# Altium project RFID_Reader_Writer.PrjPcb
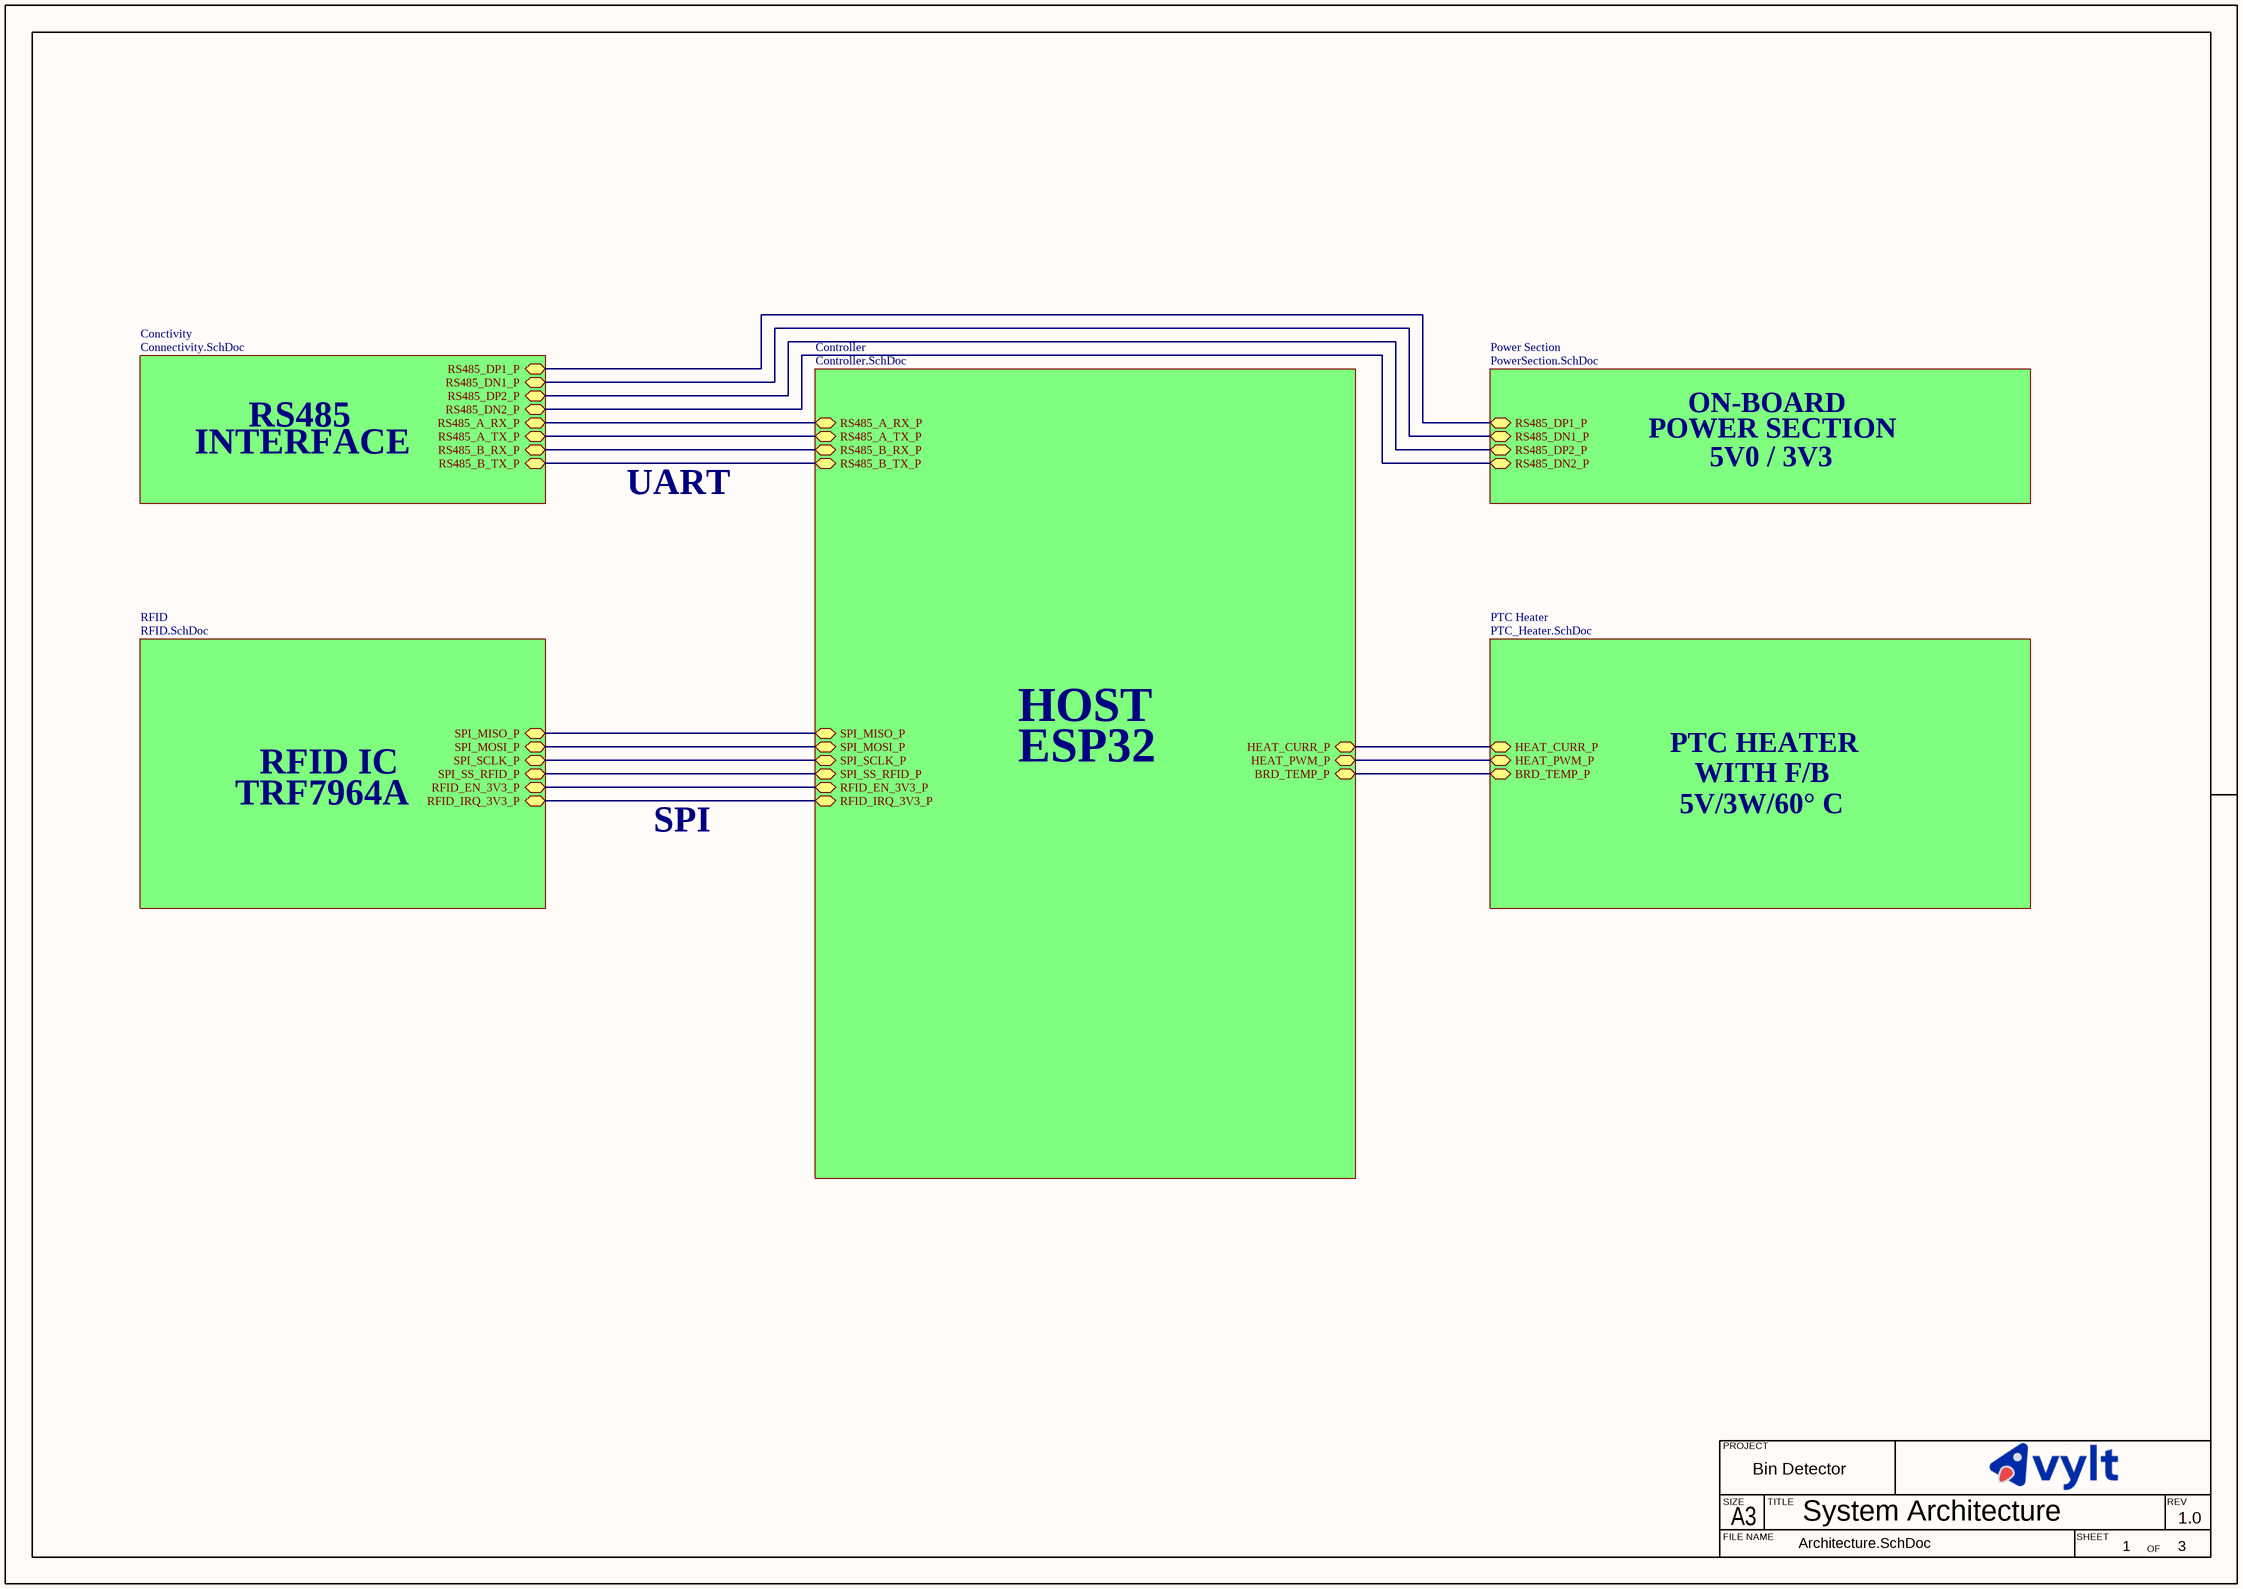
[diagram p0: Architecture.SchDoc]
Project: Bin Detector; Revision: 1.0
2 sheets, 27 parts. Net scope: hierarchical (ports join the sheet entries above them; power ports are global).
Board file: RFID_Reader_Writer.PcbDoc
Sheets:
  Architecture.SchDoc
    Controller = Controller.SchDoc

## Sheet Architecture.SchDoc: System Architecture
size 420 x 297 mm; SheetNumber: 1; SheetTotal: 3; DOC_NO_SCH_DWG: 1

### Sub-sheets
Conctivity = Connectivity.SchDoc (file not in this document): RS485_A_TX_P (bidir), RS485_A_RX_P (bidir), RS485_DP1_P (bidir), RS485_DN1_P (bidir), RS485_B_TX_P (bidir), RS485_B_RX_P (bidir), RS485_DP2_P (bidir), RS485_DN2_P (bidir)
Controller = Controller.SchDoc: SPI_MOSI_P (bidir), SPI_SCLK_P (bidir), SPI_SS_RFID_P (bidir), RFID_EN_3V3_P (bidir), RFID_IRQ_3V3_P (bidir), RS485_A_TX_P (bidir), RS485_A_RX_P (bidir), SPI_MISO_P (bidir), HEAT_CURR_P (bidir), BRD_TEMP_P (bidir), HEAT_PWM_P (bidir), RS485_B_TX_P (bidir), RS485_B_RX_P (bidir)
Power Section = PowerSection.SchDoc (file not in this document): RS485_DP1_P (bidir), RS485_DN1_P (bidir), RS485_DP2_P (bidir), RS485_DN2_P (bidir)
PTC Heater = PTC_Heater.SchDoc (file not in this document): HEAT_CURR_P (bidir), BRD_TEMP_P (bidir), HEAT_PWM_P (bidir)
RFID = RFID.SchDoc (file not in this document): SPI_MISO_P (bidir), SPI_MOSI_P (bidir), SPI_SCLK_P (bidir), SPI_SS_RFID_P (bidir), RFID_EN_3V3_P (bidir), RFID_IRQ_3V3_P (bidir)

### Nets
BRD_TEMP: sheet Controller/BRD_TEMP_P, sheet PTC Heater/BRD_TEMP_P
HEAT_CURR: sheet Controller/HEAT_CURR_P, sheet PTC Heater/HEAT_CURR_P
HEAT_PWM: sheet Controller/HEAT_PWM_P, sheet PTC Heater/HEAT_PWM_P
RFID_3V3_EN: sheet RFID/RFID_EN_3V3_P, sheet Controller/RFID_EN_3V3_P
RFID_3V3_IRQ: sheet RFID/RFID_IRQ_3V3_P, sheet Controller/RFID_IRQ_3V3_P
RS485_A_RX: sheet Controller/RS485_A_RX_P, sheet Conctivity/RS485_A_RX_P
RS485_A_TX: sheet Controller/RS485_A_TX_P, sheet Conctivity/RS485_A_TX_P
RS485_B_RX: sheet Controller/RS485_B_RX_P, sheet Conctivity/RS485_B_RX_P
RS485_B_TX: sheet Controller/RS485_B_TX_P, sheet Conctivity/RS485_B_TX_P
SPI_MISO: sheet RFID/SPI_MISO_P, sheet Controller/SPI_MISO_P
SPI_MOSI: sheet RFID/SPI_MOSI_P, sheet Controller/SPI_MOSI_P
SPI_RFID_SS: sheet RFID/SPI_SS_RFID_P, sheet Controller/SPI_SS_RFID_P
SPI_SCLK: sheet RFID/SPI_SCLK_P, sheet Controller/SPI_SCLK_P
(unnamed): sheet Conctivity/RS485_DP1_P, sheet Power Section/RS485_DP1_P
(unnamed): sheet Conctivity/RS485_DN1_P, sheet Power Section/RS485_DN1_P
(unnamed): sheet Conctivity/RS485_DP2_P, sheet Power Section/RS485_DP2_P
(unnamed): sheet Conctivity/RS485_DN2_P, sheet Power Section/RS485_DN2_P

### Notes on the sheet
- INTERFACE
- RS485
- POWER SECTION
- ON-BOARD
- UART
- 5V0 / 3V3
- HOST
- RFID IC
- ESP32
- PTC HEATER
- WITH F/B
- TRF7964A
- SPI
- 5V/3W/60° C
- PROJECT
- SIZE
- FILE NAME
- A3
- TITLE
- SHEET
- OF
- REV

## Sheet Controller.SchDoc: Controller Section
size 420 x 297 mm
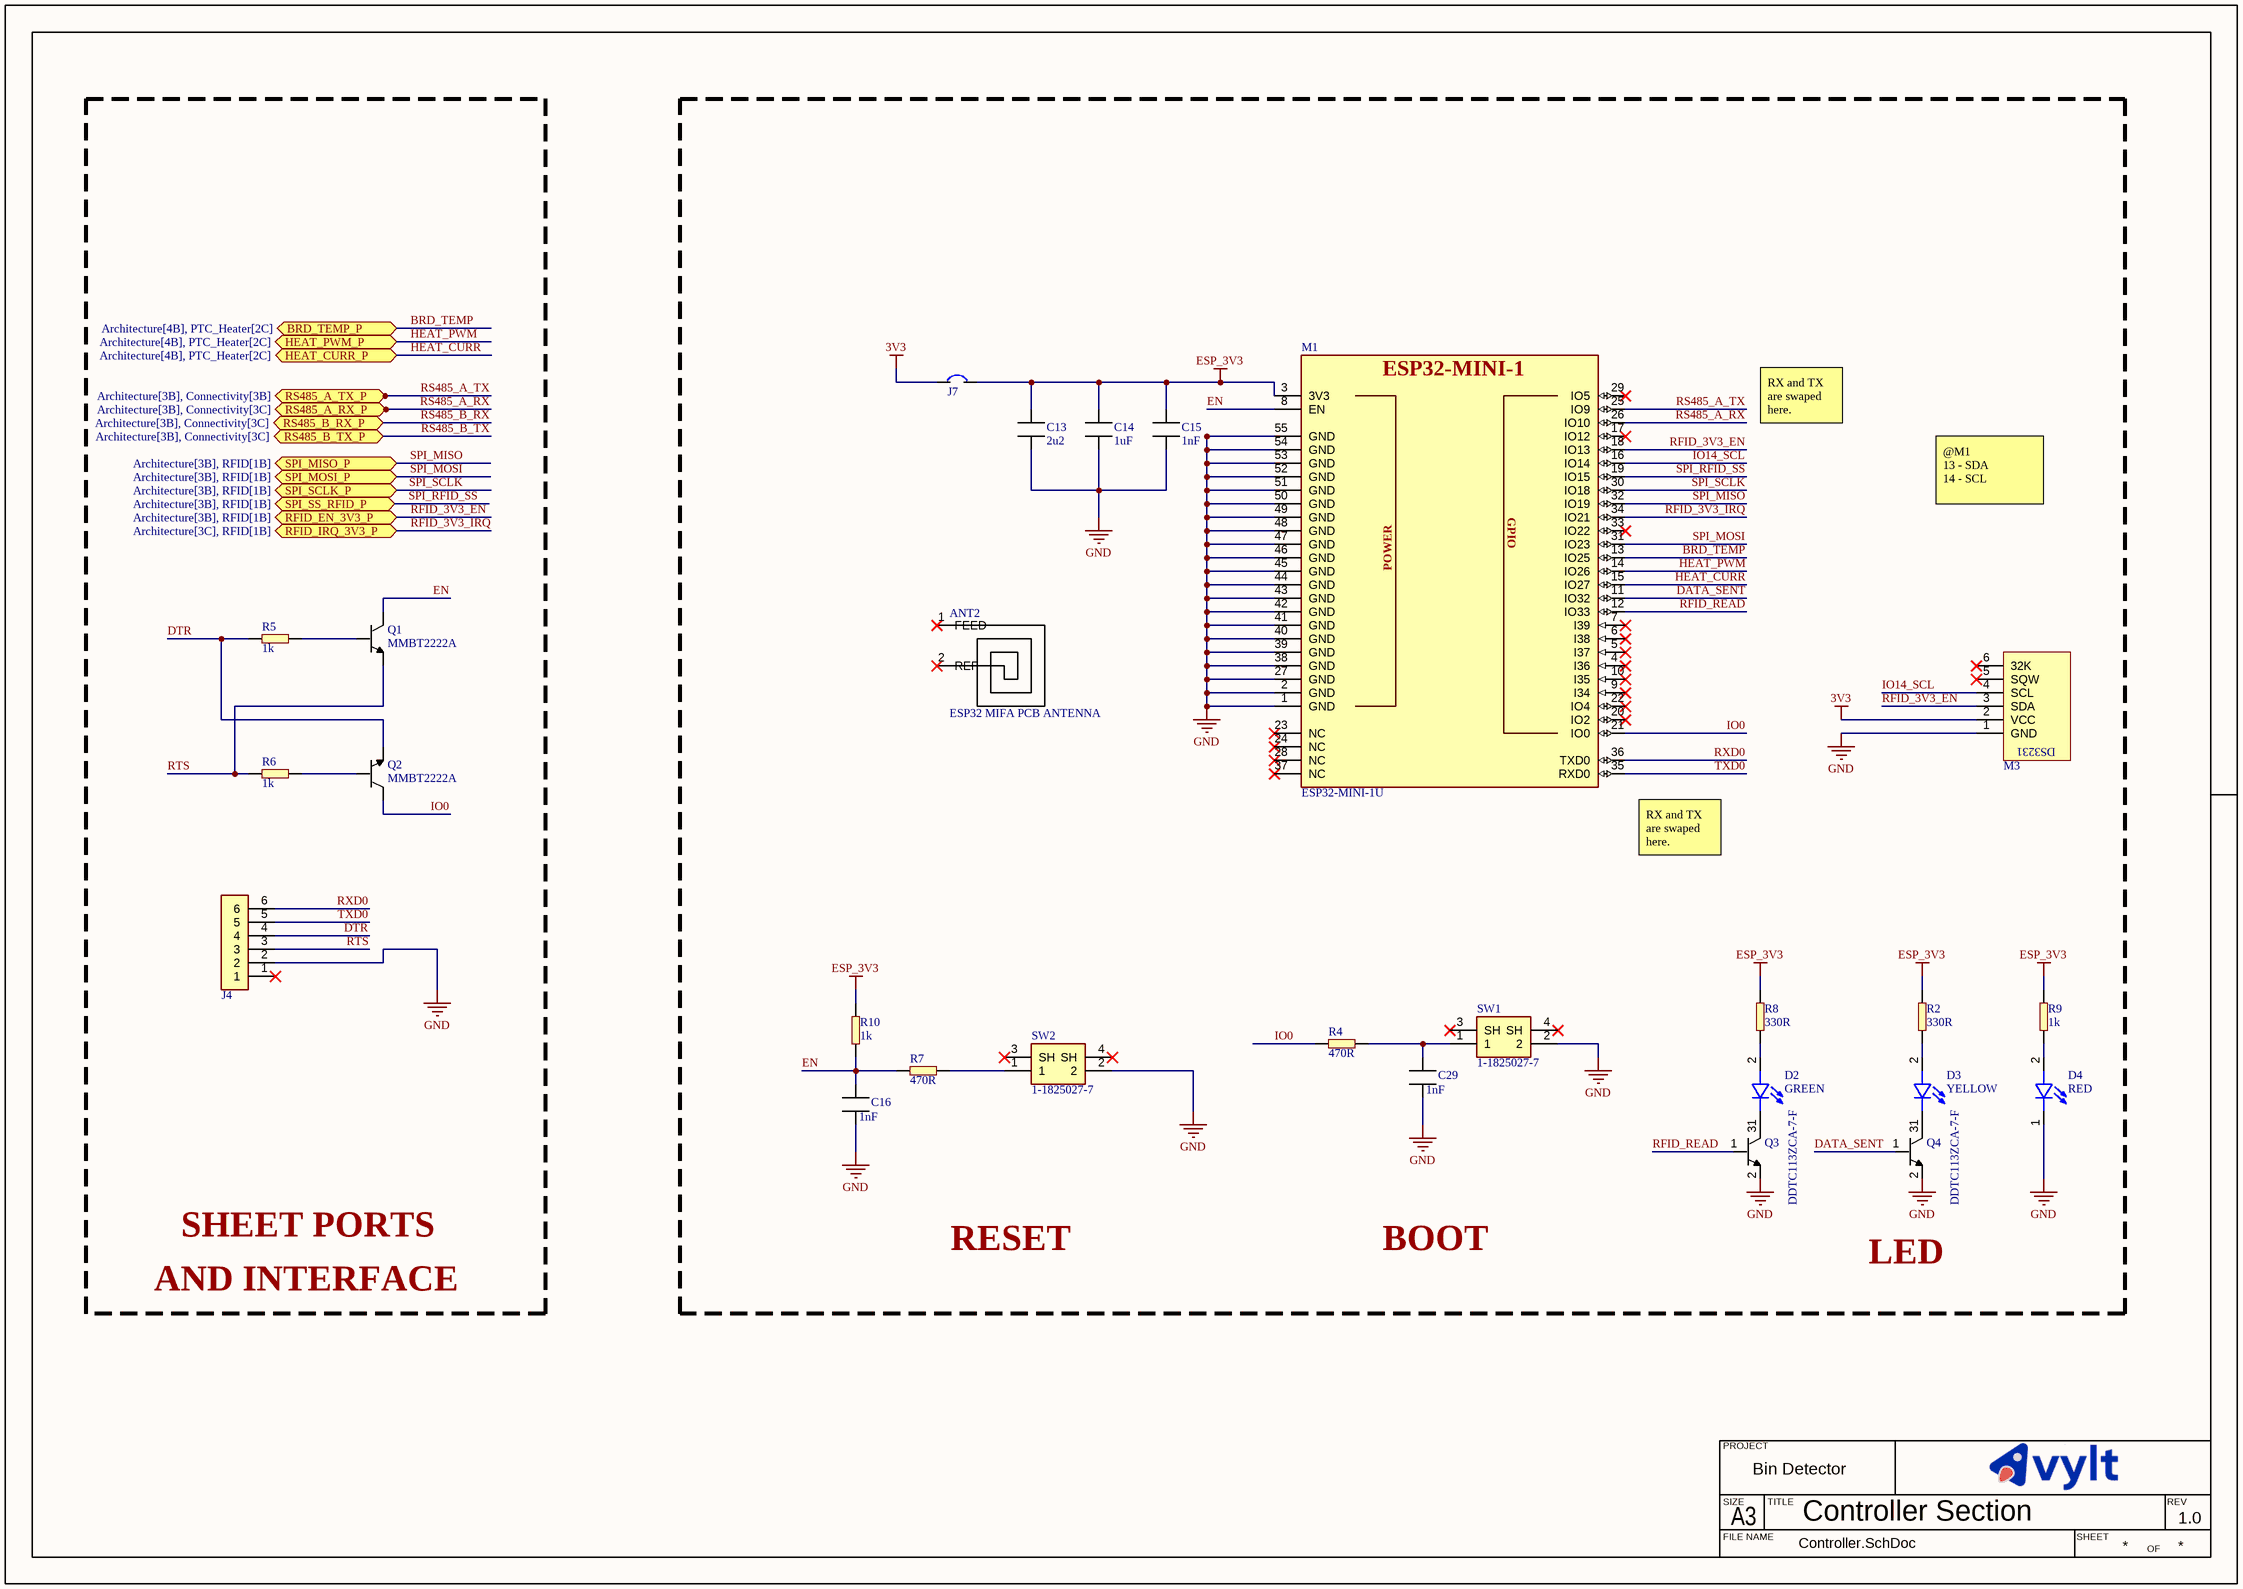
[diagram p1: Controller.SchDoc]

### Parts
ANT2  ESP32 MIFA PCB ANTENNA  [ESP32 MIFA PCB ANTENNA]  (no BOM)
C13  value 2u2  [CAPC1608X10N]  (hidden comment: ERP_102-1)
C14  value 1uF  [CAPC1608X10N]  (hidden comment: ERP_102-1)
C15  value 1nF  [CAPC1608X10N]  (hidden comment: ERP_102-1)
C16  value 1nF  [CAPC1608X10N]  (hidden comment: ERP_102-1)
C29  value 1nF  [CAPC1608X10N]  (hidden comment: ERP_102-1)
D2  value GREEN  [LED_2SMD]  (hidden comment: LED_2SMD)
D3  value YELLOW  [LED_2SMD]  (hidden comment: LED_2SMD)
D4  value RED  [LED_2SMD]  (hidden comment: LED_2SMD)
J4  ERP_148-2  [6PX1R]  (value not drawn)  (no BOM)
J7  Jumper_2P  [Jumper_2P]  (value not drawn)  (no BOM)
M1  value ESP32-MINI-1U  [ESP32_MINI_1U]  (hidden comment: ERP_140-3)
M3  DS3231_HW-084  [DS3231_HW-084]  (value not drawn)
Q1  value MMBT2222A  [MMBT2222]  (hidden comment: ERP_105-1)
Q2  value MMBT2222A  [MMBT2222]  (hidden comment: ERP_105-1)
Q3  value DDTC113ZCA-7-F  [DDTCXXXXCA]  (hidden comment: ERP_105-1)
Q4  value DDTC113ZCA-7-F  [DDTCXXXXCA]  (hidden comment: ERP_105-1)
R2  value 330R  [RES_0603]  (hidden comment: ERP_101-1)
R4  value 470R  [RES_0603]  (hidden comment: ERP_101-1)
R5  value 1k  [RES_0603]  (hidden comment: ERP_101-1)
R6  value 1k  [RES_0603]  (hidden comment: ERP_101-1)
R7  value 470R  [RES_0603]  (hidden comment: ERP_101-1)
R8  value 330R  [RES_0603]  (hidden comment: ERP_101-1)
R9  value 1k  [RES_0603]  (hidden comment: ERP_101-1)
R10  value 1k  [RES_0603]  (hidden comment: ERP_101-1)
SW1  value 1-1825027-7  [FSM_6X6]  (hidden comment: ERP_110-4)
SW2  value 1-1825027-7  [FSM_6X6]  (hidden comment: ERP_110-4)

### Ports
BRD_TEMP_P (bidir, see Architecture[4B], PTC_Heater[2C]), HEAT_CURR_P (bidir, see Architecture[4B], PTC_Heater[2C]), HEAT_PWM_P (bidir, see Architecture[4B], PTC_Heater[2C]), RFID_EN_3V3_P (bidir, see Architecture[3B], RFID[1B]), RFID_IRQ_3V3_P (bidir, see Architecture[3C], RFID[1B]), RS485_A_RX_P (bidir, see Architecture[3B], Connectivity[3C]), RS485_A_TX_P (bidir, see Architecture[3B], Connectivity[3B]), RS485_B_RX_P (bidir, see Architecture[3B], Connectivity[3C]), RS485_B_TX_P (bidir, see Architecture[3B], Connectivity[3C]), SPI_MISO_P (bidir, see Architecture[3B], RFID[1B]), SPI_MOSI_P (bidir, see Architecture[3B], RFID[1B]), SPI_SCLK_P (bidir, see Architecture[3B], RFID[1B]), SPI_SS_RFID_P (bidir, see Architecture[3B], RFID[1B])

### Nets
3V3: J7.1 M3.2(VCC)
ESP_3V3: C13.2 C14.2 C15.2 J7.2 M1.3(3V3) R2.2 R8.2 R9.2 R10.2
GND: C13.1 C14.1 C15.1 C16.2 C29.2 D4.1 J4.2 M1.1(GND) M1.2(GND) M1.27(GND) M1.38(GND) M1.39(GND) M1.40(GND) M1.41(GND) M1.42(GND) M1.43(GND) M1.44(GND) M1.45(GND) M1.46(GND) M1.47(GND) M1.48(GND) M1.49(GND) M1.50(GND) M1.51(GND) M1.52(GND) M1.53(GND) M1.54(GND) M1.55(GND) M3.1(GND) Q3.2 Q4.2 SW1.2 SW2.2
BRD_TEMP: M1.13(IO25) ; port BRD_TEMP_P
DATA_SENT: M1.11(IO32) Q4.1
DTR: J4.4 Q2.2 R5.2
EN: C16.1 M1.8(EN) Q1.3 R7.2 R10.1
HEAT_CURR: M1.15(IO27) ; port HEAT_CURR_P
HEAT_PWM: M1.14(IO26) ; port HEAT_PWM_P
IO0: M1.21(IO0) Q2.3 R4.2
IO14_SCL: M1.16(IO14) M3.4(SCL)
RFID_3V3_EN: M1.18(IO13) M3.3(SDA) ; port RFID_EN_3V3_P
RFID_3V3_IRQ: M1.34(IO21) ; port RFID_IRQ_3V3_P
RFID_READ: M1.12(IO33) Q3.1
RS485_A_RX: M1.26(IO10) ; port RS485_A_RX_P
RS485_A_TX: M1.25(IO9) ; port RS485_A_TX_P
RTS: J4.3 Q1.2 R6.2
RXD0: J4.6 M1.36(TXD0)
SPI_MISO: M1.32(IO19) ; port SPI_MISO_P
SPI_MOSI: M1.31(IO23) ; port SPI_MOSI_P
SPI_RFID_SS: M1.19(IO15) ; port SPI_SS_RFID_P
SPI_SCLK: M1.30(IO18) ; port SPI_SCLK_P
TXD0: J4.5 M1.35(RXD0)
NetC29_1: C29.1 R4.1 SW1.1
NetD2_1: D2.1 Q3.3
NetD2_2: D2.2 R8.1
NetD3_1: D3.1 Q4.3
NetD3_2: D3.2 R2.1
NetD4_2: D4.2 R9.1
NetQ1_1: Q1.1 R5.1
NetQ2_1: Q2.1 R6.1
NetR7_1: R7.1 SW2.1

Not connected (* = marked no-connect by the designer): ANT2 1(FEED)* 2(REF)*; J4 1*; M1 4(I36)* 5(I37)* 6(I38)* 7(I39)* 9(I34)* 10(I35)* 17(IO12)* 20(IO2)* 22(IO4)* 23(NC)* 24(NC)* 28(NC)* 29(IO5)* 33(IO22)* 37(NC)*; M3 5(SQW)* 6(32K)*; SW1 3(SH)* 4(SH)*; SW2 3(SH)* 4(SH)*

### Notes on the sheet
- RX and TX are swaped here.
- @M1
  13 - SDA
  14 - SCL
- (near M1) RX and TX are swaped here.
- SHEET PORTS
- RESET
- BOOT
- LED
- AND INTERFACE
- PROJECT
- SIZE
- FILE NAME
- A3
- TITLE
- SHEET
- OF
- REV
- (in symbol DS3231_HW-084) DS3231
- (in symbol ESP32_MINI_1) ESP32-MINI-1; GPIO; POWER

### Library data of the parts
C13 = MLCC_0603: MLCC 0603; Manufacturer 1: Murata Electronics; Manufacturer Part Number 1: GRT188R61H225KE13D; Package: 0603; Suuplier Part Number 1: *; ERP: *; Supplier 1: Digikey; Supplier Part Number 1: 490-12332-1-ND
C14 = MLCC_0603: MLCC 0603; Manufacturer 1: Samsung Electro-Mechanics; Manufacturer Part Number 1: CL10A105KB8NNNC; Package: 0603; Supplier 1: *; Suuplier Part Number 1: *; ERP: *
C15 C16 C29 = MLCC_0603: MLCC 0603; Manufacturer 1: Samsung Electro-Mechanics; Manufacturer Part Number 1: CL10C102JB8NNNC; Package: 0603; Suuplier Part Number 1: *; ERP: *; Supplier 1: Digikey; Supplier Part Number 1: 1276-1091-1-ND
D2 = LED_2SMD: LED GREEN CLEAR 1204 SMD R/A; Manufacturer Part Number 1: 155124VS73200; Manufacturer 1: Würth Elektronik; ERP: *; Suuplier Part Number 1: *; Supplier 1: Digikey; Package: 1204
D3 = LED_2SMD: LED YELLOW CLEAR 1204 SMD R/A; Manufacturer Part Number 1: 155124YS73200; Manufacturer 1: Würth Elektronik; ERP: *; Suuplier Part Number 1: *; Supplier 1: Digikey; Package: 1204
D4 = LED_2SMD: LED RED CLEAR 1204 SMD R/A; Manufacturer Part Number 1: 155124RS73200; Manufacturer 1: Würth Elektronik; ERP: *; Suuplier Part Number 1: *; Supplier 1: Digikey; Package: 1204
J4 = 6PX1R
J7 = Jumper_2P: Jumper 2 Pins
M1 = ESP32_MINI_1: ESP32_C3_MINI_1 Module; Manufacturer Part Number 1: ESP32-MINI-1U-N4; Manufacturer 1: Espressif Systems; ERP: *; Package: 56 PIN SMD; Supplier 1: Digikey; Supplier Part Number 1: 1965-ESP32-MINI-1U-N4CT-ND
M3 = DS3231_HW-084: DS3231 Time Module , HW-084; Manufacturer 1: Generic; Manufacturer Part Number 1: HW-084(DS3231); Package: 6 Pin TH; ERP: *; Supplier 1: *; Supplier Part Number 1: *; Value: HW-084
Q1 Q2 = MMBT2222: MMBT2222A; Manufacturer Part Number 1: MMBT2222A-7-F; Manufacturer 1: Diotec Semiconductor; ERP: *; Suuplier Part Number 1: *; Supplier 1: *; Package: SOT23
Q3 Q4 = DDTCXXXXCA: TRANS PREBIAS NPN 50V SOT23-3; Manufacturer 1: Diodes Incorporated; ERP: *; Suuplier Part Number 1: *; Supplier 1: Digikey; Manufacturer Part Number 1: DDTC113ZCA-7-F; Package: SOT23
R2 R8 = RES_0603: Manufacturer 1: YAGEO; Manufacturer Part Number 1: RC0603JR-07330RL; Package: 0603; Supplier 1: *; Supplier Part Number 1: *; ERP: *
R4 R7 = RES_0603: Manufacturer 1: YAGEO; Manufacturer Part Number 1: RC0603JR-07470RL; Package: 0603; ERP: *; Supplier 1: *; Supplier Part Number 1: *; Supplier 2: Digikey; Supplier Part Number 2: 311-470GRCT-ND
R5 R6 R9 R10 = RES_0603: Manufacturer 1: YAGEO; Manufacturer Part Number 1: RC0603FR-071KL; Package: 0603; ERP: *; Supplier 1: Digikey; Supplier Part Number 1: 311-1.00KHRCT-ND
SW1 SW2 = FSM_6X6: Manufacturer 1: TE; ERP: *; Suuplier Part Number 1: *; Manufacturer Part Number 1: 1-1825027-7; Package: 6X6; Supplier 1: Digikey; Supplier Part Number 1: 450-1660-ND

## Assembly variants
Sensor: not fitted J3 M3 M4
Gateway: not fitted ANT1 C1 C5 C7 C8 C9 C10 C11 C12 C17 C18 C19 C20 C21 C22 C23 C24 C25 C26 C28 C31 C32 C34 C36 C37 C38 C39 C40 C41 C42 C43 J1 J2 L1 L2 R1 R3 R11 R12 R13 R14 R15 R16 R17 R18 R19 R20 R21 R28 R29 R30 R31 R32 U1 X1